# Altium schematic sheet I2C_Sensor.SchDoc
size 420 x 297 mm; SheetNumber: 20; SheetTotal: 21
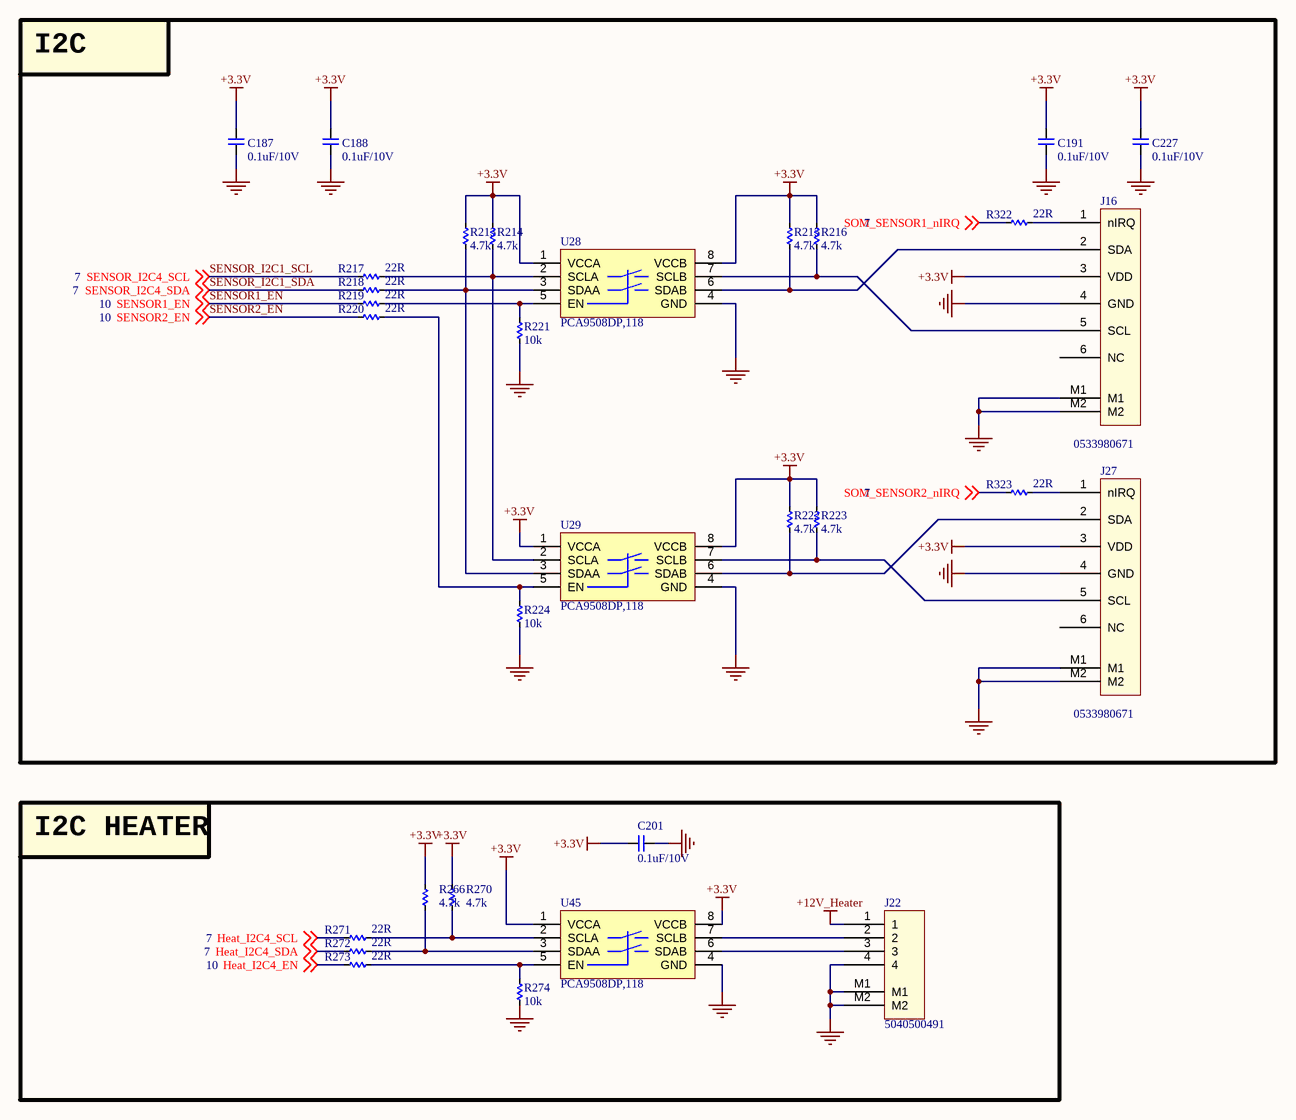
[diagram p0: I2C_Sensor.SchDoc]

## Parts
C187  0.1uF/10V  [CAP_C_1005X60]
C188  0.1uF/10V  [CAP_C_1005X60]
C191  0.1uF/10V  [CAP_C_1005X60]
C201  0.1uF/10V  [CAP_C_1005X60]
C227  0.1uF/10V  [CAP_C_1005X60]
J16  0533980671  [MOLEX_0533980671]
J22  5040500491  [MOLEX_5040500491]
J27  0533980671  [MOLEX_0533980671]
R213  4.7k  [RES_C_1005X40]
R214  4.7k  [RES_C_1005X40]
R215  4.7k  [RES_C_1005X40]
R216  4.7k  [RES_C_1005X40]
R217  22R  [RES_C_1005X40]
R218  22R  [RES_C_1005X40]
R219  22R  [RES_C_1005X40]
R220  22R  [RES_C_1005X40]
R221  10k  [RES_C_1005X40]
R222  4.7k  [RES_C_1005X40]
R223  4.7k  [RES_C_1005X40]
R224  10k  [RES_C_1005X40]
R266  4.7k  [RES_C_1005X40]
R270  4.7k  [RES_C_1005X40]
R271  22R  [RES_C_1005X40]
R272  22R  [RES_C_1005X40]
R273  22R  [RES_C_1005X40]
R274  10k  [RES_C_1005X40]
R322  22R  [RES_C_1005X40]
R323  22R  [RES_C_1005X40]
U28  PCA9508DP,118  [TSOP8]
U29  PCA9508DP,118  [TSOP8]
U45  PCA9508DP,118  [TSOP8]

## Blocks framed on the sheet
I2C: C187 C188 C191 C227 J16 J27 R213-R224 R322 R323 U28 U29
I2C HEATER: C201 J22 R266 R270-R274 U45

## Nets
+3.3V: C187.2 C188.2 C191.2 C201.2 C227.2 J16.3(VDD) J27.3(VDD) R213.1 R214.1 R215.1 R216.1 R222.1 R223.1 R266.1 R270.1 U28.1(VCCA) U28.8(VCCB) U29.1(VCCA) U29.8(VCCB) U45.1(VCCA) U45.8(VCCB)
+12V_Heater: J22.1
GND: C187.1 C188.1 C191.1 C201.1 C227.1 J16.4(GND) J16.M1 J16.M2 J22.4 J22.M1 J22.M2 J27.4(GND) J27.M1 J27.M2 R221.2 R224.2 R274.2 U28.4(GND) U29.4(GND) U45.4(GND)
Heat_I2C4_EN: R273.2 ; off-sheet Heat_I2C4_EN
Heat_I2C4_SCL: R271.2 ; off-sheet Heat_I2C4_SCL
Heat_I2C4_SDA: R272.2 ; off-sheet Heat_I2C4_SDA
SENSOR1_EN: R219.2 ; off-sheet SENSOR1_EN
SENSOR2_EN: R220.2 ; off-sheet SENSOR2_EN
SENSOR_I2C1_SCL: R217.2 ; off-sheet SENSOR_I2C4_SCL  [also labelled SENSOR_I2C4_SCL]
SENSOR_I2C1_SDA: R218.2 ; off-sheet SENSOR_I2C4_SDA  [also labelled SENSOR_I2C4_SDA]
SOM_SENSOR1_nIRQ: R322.2 ; off-sheet SOM_SENSOR1_nIRQ
SOM_SENSOR2_nIRQ: R323.2 ; off-sheet SOM_SENSOR2_nIRQ
NetJ16_1: J16.1(nIRQ) R322.1
NetJ16_2: J16.2(SDA) R215.2 U28.6(SDAB)
NetJ16_5: J16.5(SCL) R216.2 U28.7(SCLB)
NetJ22_2: J22.2 U45.7(SCLB)
NetJ22_3: J22.3 U45.6(SDAB)
NetJ27_1: J27.1(nIRQ) R323.1
NetJ27_2: J27.2(SDA) R222.2 U29.6(SDAB)
NetJ27_5: J27.5(SCL) R223.2 U29.7(SCLB)
NetR213_2: R213.2 R218.1 U28.3(SDAA) U29.3(SDAA)
NetR214_2: R214.2 R217.1 U28.2(SCLA) U29.2(SCLA)
NetR219_1: R219.1 R221.1 U28.5(EN)
NetR220_1: R220.1 R224.1 U29.5(EN)
NetR266_2: R266.2 R272.1 U45.3(SDAA)
NetR270_2: R270.2 R271.1 U45.2(SCLA)
NetR273_1: R273.1 R274.1 U45.5(EN)

Not connected (* = marked no-connect by the designer): J16 6(NC); J27 6(NC)

## Notes on the sheet
- Project:
- Sub-system:
- Design by:
- Sheet title:
- Sheet
- of
- Checked by:
- Approved by:
- Revision:
- Document No:
- Size:
- Date:
- A3

## Library data of the parts
C187 C188 C191 C201 C227 = _CAP_C_2: CAP CHIP
J16 J27 = FLOW_SENSOR
J22 = Header 4x1_2M
R213-R224 R266 R270-R274 R322 R323 = _RES_B_2: RES